# EAGLE schematic untitled (EAGLE 6.1)
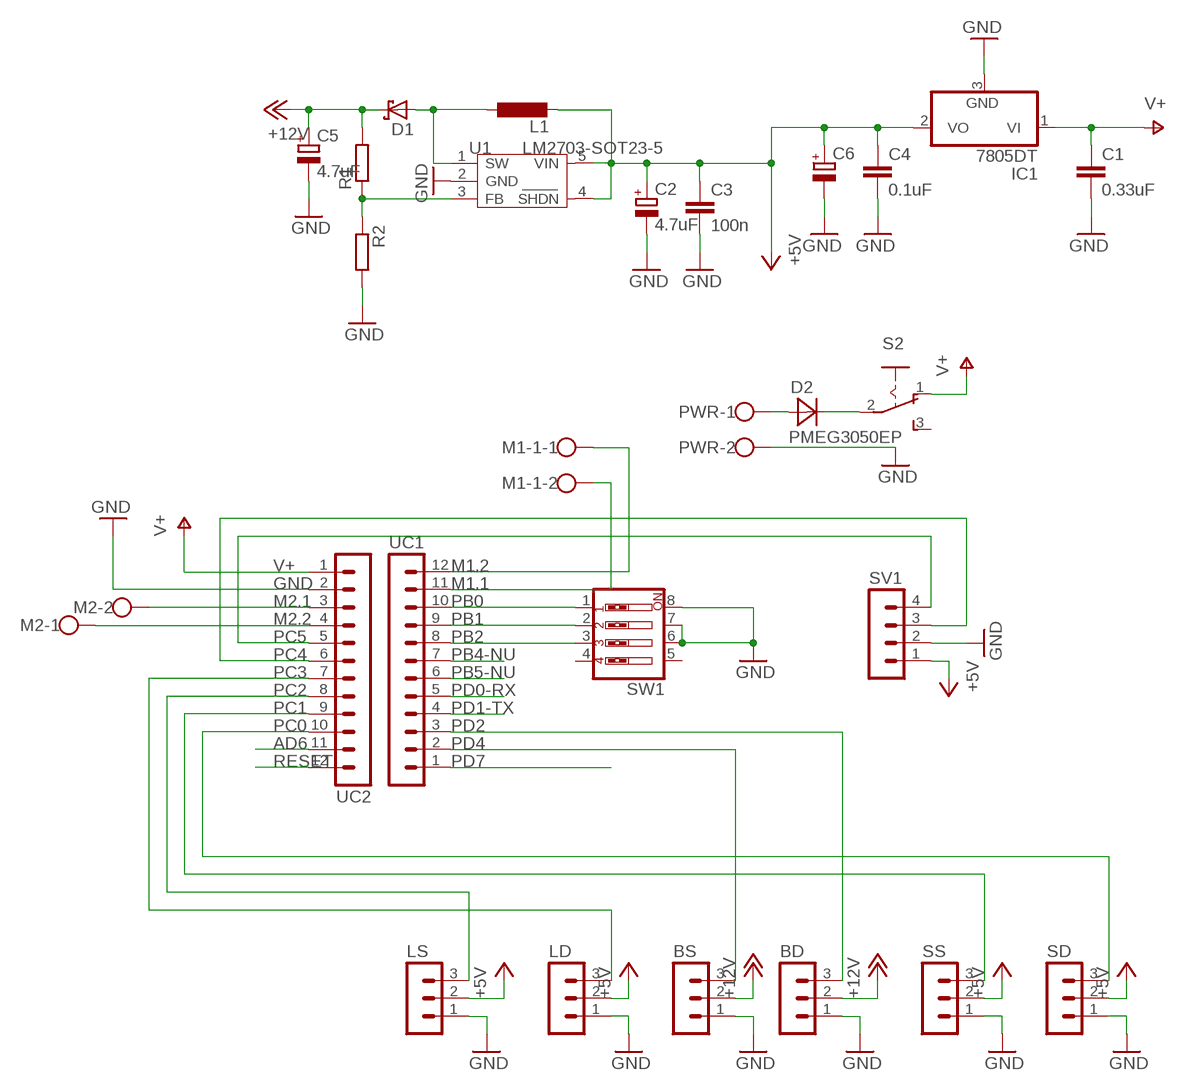
[diagram p0: schematic, sheet 1]

## Parts
BD  MA03-1  [MA03-1]
BS  MA03-1  [MA03-1]
C1  0.33uF  C-EUC0805  [C0805]
C2  4.7uF  CPOL-EU153CLV-0405  [153CLV-0405]
C3  100n  C-EUC0805  [C0805]
C4  0.1uF  C-EUC0805  [C0805]
C5  4.7uF  CPOL-EU153CLV-0405  [153CLV-0405]
C6  CPOL-EU153CLV-0605  [153CLV-0605]
D1  SCHOTTKY-DIODESMD  [SMB]
D2  PMEG3050EP  MBRA340T3  [SMA]
IC1  7805DT  [TO252]
L1  L-EUL4532C  [L4532M]
LD  MA03-1  [MA03-1]
LS  MA03-1  [MA03-1]
M1-1  W237-102  [W237-102]
M2  W237-102  [W237-102]
PWR  W237-102  [W237-102]
R1  R-EU_R0805  [R0805]
R2  R-EU_R0805  [R0805]
S2  M251  [M251]
SD  MA03-1  [MA03-1]
SS  MA03-1  [MA03-1]
SV1  MA04-1  [MA04-1]
SW1  SW_DIP-4  [EDG-04]
U1  LM2703-SOT23-5  [SOT23-5]
UC1  MA12-1  [MA12-1]
UC2  MA12-1  [MA12-1]

## Nets
+5V: C2.+ C3.1 C4.1 C6.+ IC1.2(VO) L1.2 LD.2 LS.2 SD.2 SS.2 SV1.1 U1.4(SHDN) U1.5(VIN)
+12V: BD.2 BS.2 C5.+ D1.C R1.2
AD6: UC2.11
GND: BD.1 BS.1 C1.2 C2.- C3.2 C4.2 C5.- C6.- IC1.3(GND) LD.1 LS.1 PWR.2 R2.2 SD.1 SS.1 SV1.2 SW1.6 SW1.7 SW1.8 U1.2(GND) UC2.2
M1.1: M1-1.2 UC1.11
M1.2: M1-1.1 UC1.12
M2.1: M2.2 UC2.3
M2.2: M2.1 UC2.4
N$1: D1.A L1.1 U1.1(SW)
N$3: D2.A PWR.1
N$16: D2.C S2.2(P)
N$18: R1.1 R2.1 U1.3(FB)
PB0: SW1.1 UC1.10
PB1: SW1.2 UC1.9
PB2: SW1.3 UC1.8
PB4-NU: UC1.7
PB5-NU: UC1.6
PC0: SD.3 UC2.10
PC1: SS.3 UC2.9
PC2: LS.3 UC2.8
PC3: LD.3 UC2.7
PC4: SV1.3 UC2.6
PC5: SV1.4 UC2.5
PD0-RX: UC1.5
PD1-TX: UC1.4
PD2: BD.3 UC1.3
PD4: BS.3 UC1.2
PD7: UC1.1
RESET: UC2.12
V+: C1.1 IC1.1(VI) S2.1(O) UC2.1
Unconnected: S2.3(S) SW1.4 SW1.5

## Library data of the parts
BD BS LD LS SD SS = con-lstb:MA03-1: PIN HEADER; OC_FARNELL: unknown; OC_NEWARK: unknown
C1 C3 C4 = rcl:C-EU: CAPACITOR, European symbol
C2 C5 C6 = rcl:CPOL-EU: POLARIZED CAPACITOR, European symbol
D1 = diode:SCHOTTKY-DIODE: Schottky Diode
D2 = diode:MBRA340T3: Surface Mount Schottky Power Rectifier Source: http://www.onsemi.com/pub_link/Collateral/MBRA340T3-D.PDF
IC1 = linear:78*: Positive VOLTAGE REGULATOR Source: http://cache.national.com/ds/LM/LM78L05.pdf http://www.fairchildsemi.com/ds/LM/LM7805.pdf
L1 = rcl:L-EU: INDUCTOR, European symbol
M1-1 M2 PWR = con-wago-500:W237-102: WAGO SCREW CLAMP; MPN: 237-102; OC_FARNELL: unknown; OC_NEWARK: 70K9898
R1 R2 = rcl:R-EU_: RESISTOR, European symbol
S2 = switch:M251: SLIDING SWITCH Mors, distributor Buerklin, 11G702
SV1 = con-lstb:MA04-1: PIN HEADER; OC_FARNELL: unknown; OC_NEWARK: unknown
SW1 = special:SW_DIP-4: DIP SWITCH
U1 = IC:LM2703: Micropower Step-Up DC/DC Converter with 350mA Peak Current Limit http://www.ti.com/lit/ds/symlink/lm2703.pdf
UC1 UC2 = con-lstb:MA12-1: PIN HEADER; OC_FARNELL: unknown; OC_NEWARK: unknown